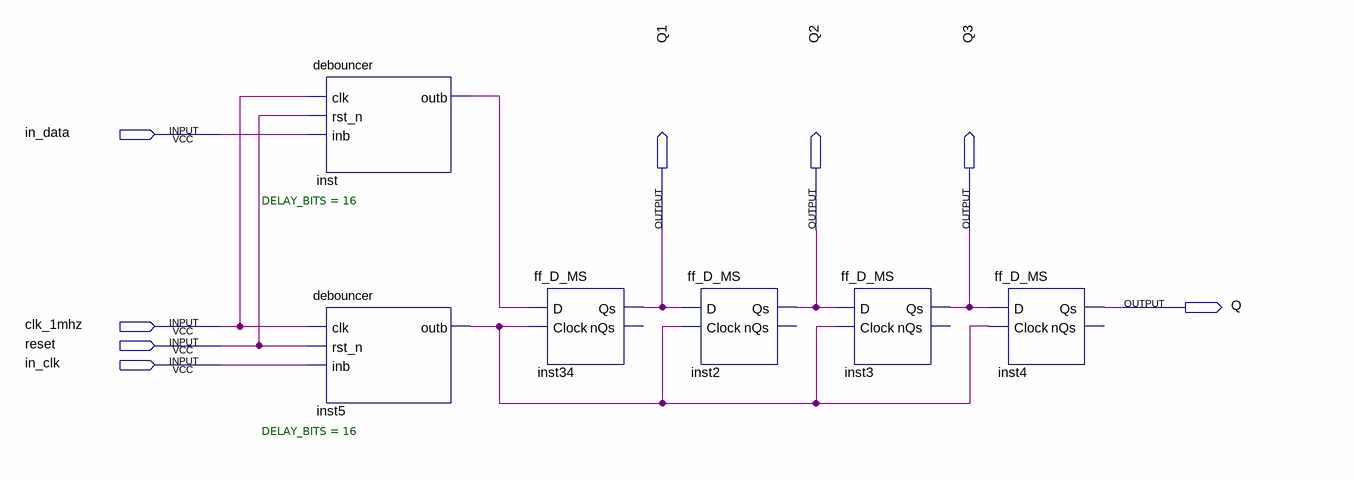
[diagram p0: schematic sheet]
// Quartus schematic shift_register.bdf as structural Verilog: 6 symbols, 8 pins
module shift_register (
  input  in_data,
  input  clk_1mhz,
  input  reset,
  input  in_clk,
  output Q1,
  output Q2,
  output Q3,
  output Q
);

  wire inst5_outb, inst_outb;

  debouncer #(.DELAY_BITS(16)) inst (.clk(clk_1mhz), .rst_n(reset), .inb(in_data), .outb(inst_outb));
  debouncer #(.DELAY_BITS(16)) inst5 (.clk(clk_1mhz), .rst_n(reset), .inb(in_clk), .outb(inst5_outb));
  ff_D_MS inst34 (.D(inst_outb), .Clock(inst5_outb), .Qs(Q1));  // open: nQs
  ff_D_MS inst2 (.D(Q1), .Clock(inst5_outb), .Qs(Q2));  // open: nQs
  ff_D_MS inst3 (.D(Q2), .Clock(inst5_outb), .Qs(Q3));  // open: nQs
  ff_D_MS inst4 (.D(Q3), .Clock(inst5_outb), .Qs(Q));  // open: nQs
endmodule
